# Altium schematic sheet XBee.SchDoc
size Letter; Organization: Altium Limited; Address1: L3, 12a Rodborough Rd; Address2: Frenchs Forest; Address3: NSW; Address4: Australia 2086
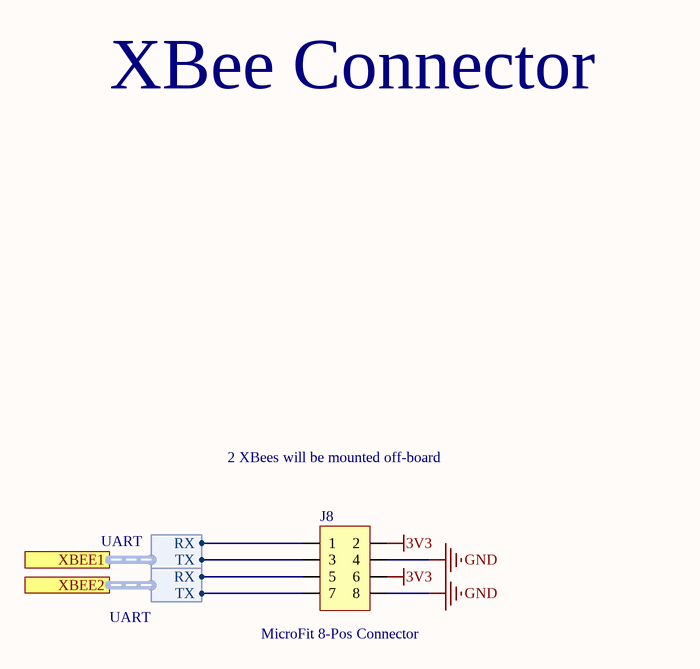
[diagram p0: XBee.SchDoc]

## Parts
J8  MicroFit 8-Pos Connector  [Microfit-8Pos]

## Ports
XBEE1 (harness UART), XBEE2 (harness UART)

## Harnesses
UART: RX, TX

## Nets
3V3: J8.2 J8.6
GND: J8.4 J8.8
NetJ8_1: J8.1 ; port XBEE1.RX
NetJ8_3: J8.3 ; port XBEE1.TX
NetJ8_5: J8.5 ; port XBEE2.RX
NetJ8_7: J8.7 ; port XBEE2.TX

## Notes on the sheet
- XBee Connector
- 2 XBees will be mounted off-board
- Title
- Size:
- Date:
- Letter
- Number:
- Time:
- Revision:
- Sheet
- of
- File:

## Library data of the parts
J8 = Micro-Fit 8Pos: Molex MicroFit 8-Pos Connector; URL: https://www.digikey.com/products/en?WT.z_cid=sp_900_0310_buynow&keywords=430450813; DigiKey PN: WM2651-ND